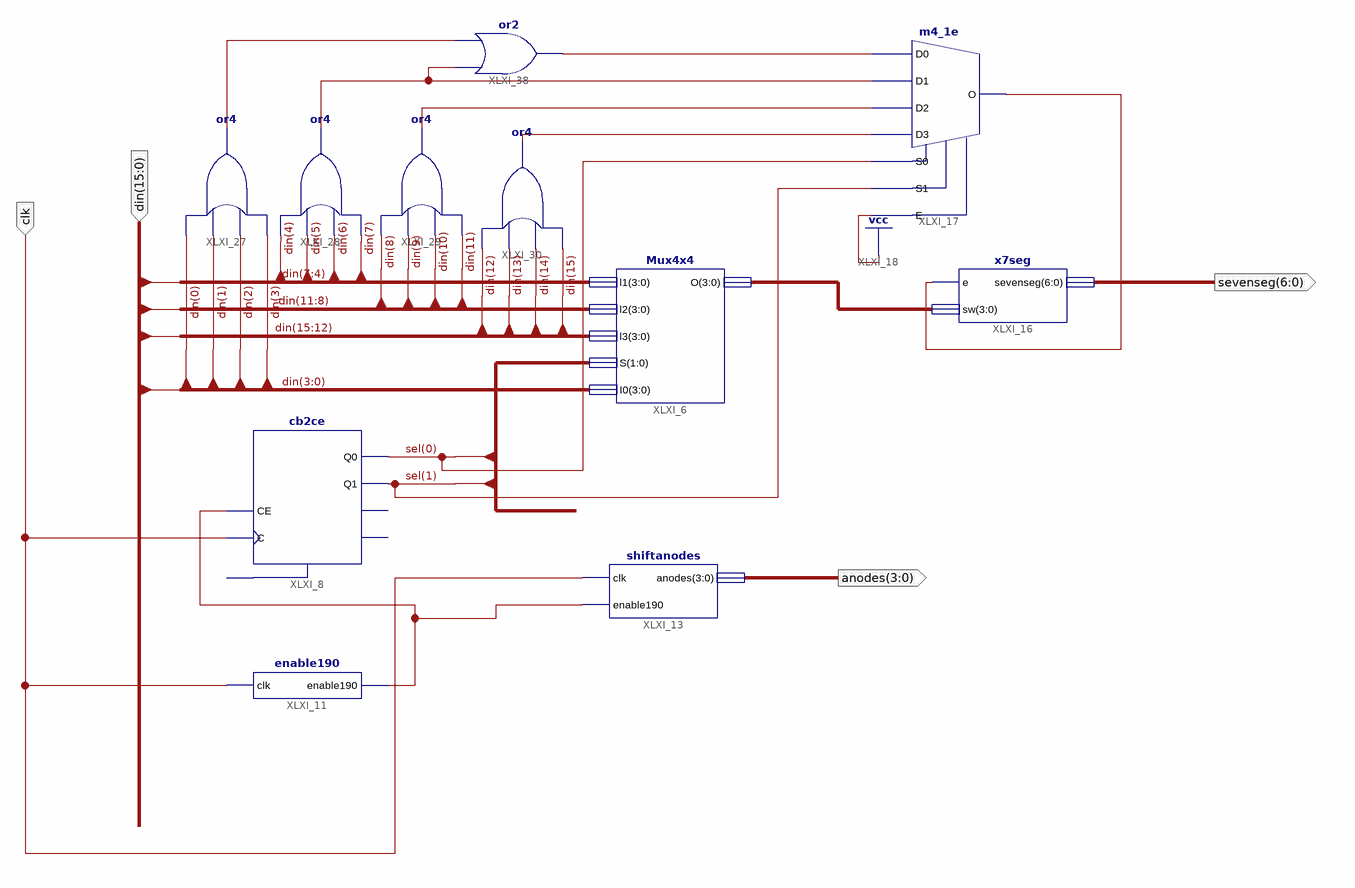
[diagram p0: schematic sheet 1]
// Xilinx ISE schematic afficheur.sch (spartan6) as structural Verilog: 11 symbols, 4 ports
module afficheur (
  input  [15:0] din,
  input  clk,
  output [3:0] anodes,
  output [6:0] sevenseg
);

  wire XLXN_55, XLXN_212, XLXN_230, XLXN_231, XLXN_234, XLXN_235, XLXN_236;
  wire [1:0] sel;
  wire [3:0] XLXN_53;

  Mux4x4 XLXI_6 (.l1(din[7:4]), .l2(din[11:8]), .l3(din[15:12]), .S(sel), .I0(din[3:0]), .O(XLXN_53));
  cb2ce XLXI_8 (.C(clk), .CE(XLXN_212), .Q0(sel[0]), .Q1(sel[1]));  // open: CLR, CEO, TC
  enable190 XLXI_11 (.clk(clk), .enable190(XLXN_212));
  shiftanodes XLXI_13 (.clk(clk), .enable190(XLXN_212), .anodes(anodes));
  x7seg XLXI_16 (.e(XLXN_55), .sw(XLXN_53), .sevenseg(sevenseg));
  m4_1e XLXI_17 (
    .D0(XLXN_236), .D1(XLXN_235), .D2(XLXN_230), .D3(XLXN_231), .E(1'b1), .S0(sel[0]), .S1(sel[1]),
    .O(XLXN_55));
  or XLXI_27 (XLXN_234, din[3], din[2], din[1], din[0]);
  or XLXI_28 (XLXN_235, din[7], din[6], din[5], din[4]);
  or XLXI_29 (XLXN_230, din[11], din[10], din[9], din[8]);
  or XLXI_30 (XLXN_231, din[15], din[14], din[13], din[12]);
  or XLXI_38 (XLXN_236, XLXN_235, XLXN_234);
endmodule
